# EAGLE design Infrared Temperature Sensor0.92 (EAGLE 5.11)
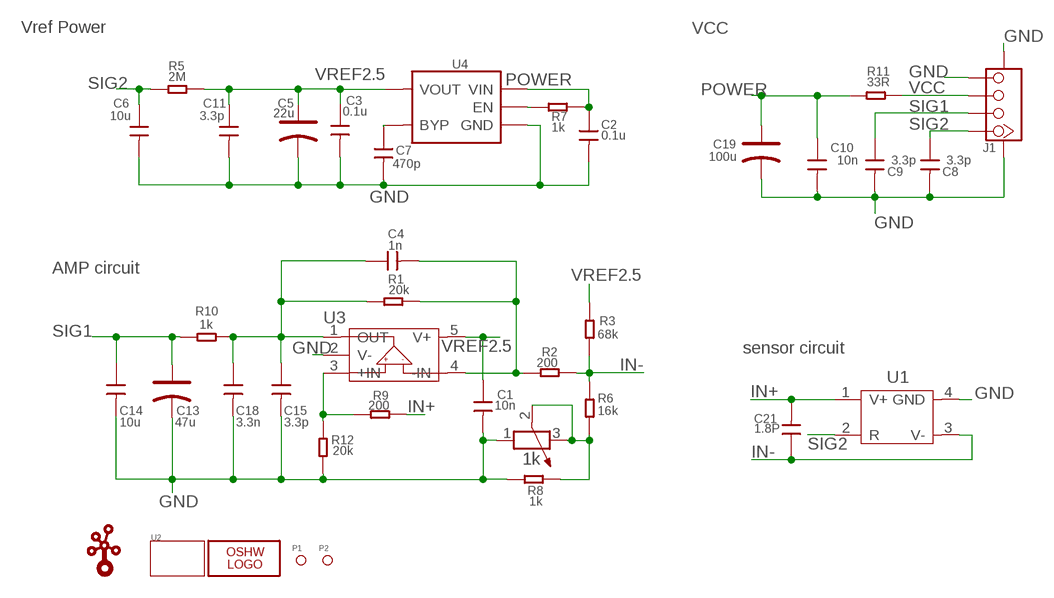
[diagram p0: schematic, sheet 1]

## Parts
C1  10n  C-0603  [0603]
C2  0.1u  C-0402  [0402]
C3  0.1u  C-0402  [0402]
C4  1n  C-0603  [0603]
C5  22u  CAP-AVX-A  [AVX-A]
C6  10u  C-0402  [0402]
C7  470p  C-0402  [0402]
C8  3.3p  C-0402  [0402]
C9  3.3p  C-0402  [0402]
C10  10n  C-0402  [0402]
C11  3.3p  C-0402  [0402]
C13  47u  CAP-AVX-A  [AVX-A]
C14  10u  C-0603  [0603]
C15  3.3p  C-0603  [0603]
C18  3.3n  C-0603  [0603]
C19  100u  CAP-AVX-B  [AVX-B]
C21  1.8P  C-0603  [0603]
J1  TWIG-4P-2.0-SMD-FEMALE-REINFORCE'90D'  [4P-SMD-2.0-90D]
LOGO1  LOGO-OSHW-FILLX0200-NT  [OSHW_FILLX200_NOTEXT]
P1  PAD-MARK  [ROUND-MARK-0.635]
P2  PAD-MARK  [ROUND-MARK-0.635]
R1  20k  R-0603  [0603]
R2  200  R-0603  [0603]
R3  68k  R-0603  [0603]
R4  1k  R-POTENTIOMETER-SMD  [3P-SMD-SQUA-3.6X3.3]
R5  2M  R-0402  [0402]
R6  16k  R-0603  [0603]
R7  1k  R-0402  [0402]
R8  1k  R-0603  [0603]
R9  200  R-0603  [0603]
R10  1k  R-0603  [0603]
R11  33R  R-0402  [0402]
R12  20k  R-0603  [0603]
U1  SENSOR-OTP-538U  [3P-5.4MM]
U2  TWIG-2U  [2U-DIM-W/-DRILL]
U3  OPA333  [SOT23-5]
U4  MIC5205  [SOT23-5]
U$1  LOGO-TWIG  [TWIGLOGO]

## Nets
GND: C1.2 C2.2 C3.2 C5.- C6.2 C7.2 C8.2 C9.2 C10.2 C11.2 C13.- C14.2 C15.2 C18.2 C19.- J1.4 J1.SS1 J1.SS2 R4.1 R8.1 R12.1 U1.4(GND) U3.2(V-) U4.2(GND)
IN+: C21.2 R9.1 U1.1(V+)
IN-: C21.1 R2.1 R3.2 R6.1 U1.3(V-)
N$1: C4.2 R1.1 R2.2 U3.4(-IN)
N$2: R4.2 R4.3 R6.2 R8.2
N$3: R7.1 U4.3(EN)
N$4: R9.2 R12.2 U3.3(+IN)
N$5: C7.1 U4.4(BYP)
N$10: C4.1 C15.1 C18.1 R1.2 R10.1 U3.1(OUT)
POWER: C2.1 C10.1 C19.+ R7.2 R11.1 U4.1(VIN)
SIG1: C9.1 C13.+ C14.1 J1.2 R10.2
SIG2: C6.1 C8.1 J1.1 R5.1 U1.2(R)
VCC: J1.3 R11.2
VREF2.5: C1.1 C3.1 C5.+ C11.1 R3.1 R5.2 U3.5(V+) U4.5(VOUT)

## Notes on the sheet
- Vref Power | VCC
- AMP circuit
- sensor circuit

## Library data of the parts
C1-C4 C6-C11 C14 C15 C18 C21 = Discrete:C*: Ceramic Capacitors
C5 C13 C19 = Discrete:CAP*: Electrolytic Capacitors,Tantalum Capacitors and Super Capacitors
J1 = Connector:TWIG-4P-2.0-SMD-FEMALE-REINFORCE
LOGO1 = Logo:LOGO-OSHW-FILL
P1 P2 = Discrete:PAD-MARK
R1-R3 R5-R12 = Discrete:R*
R4 = Discrete:R-POTENTIOMETER*: Potentiometer
U1 = Discrete:SENSOR-OTP-538U
U2 = Module:TWIG
U3 = IC:OPA333
U4 = IC:MIC5205: The MIC5205 is an efficient linear voltage regulator with ultra-low-noise output, very low dropout voltage (typically 17mV at light loads and 165mV at 150mA), and very low ground current (600µA at 100mA output). The MIC5205 offers better than 1% initial accuracy. datasheet here: http://www.micrel.com/product-info/prod/5205.shtml
U$1 = Logo:LOGO-TWIG

## Board
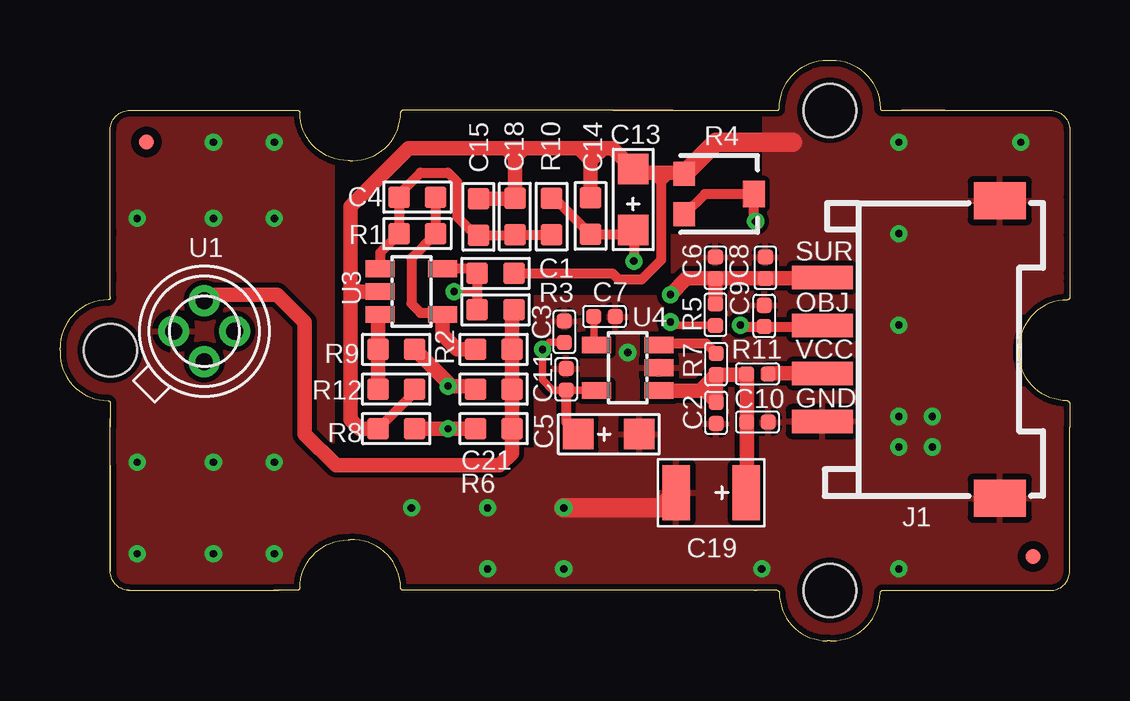
[diagram p1: board, top side]
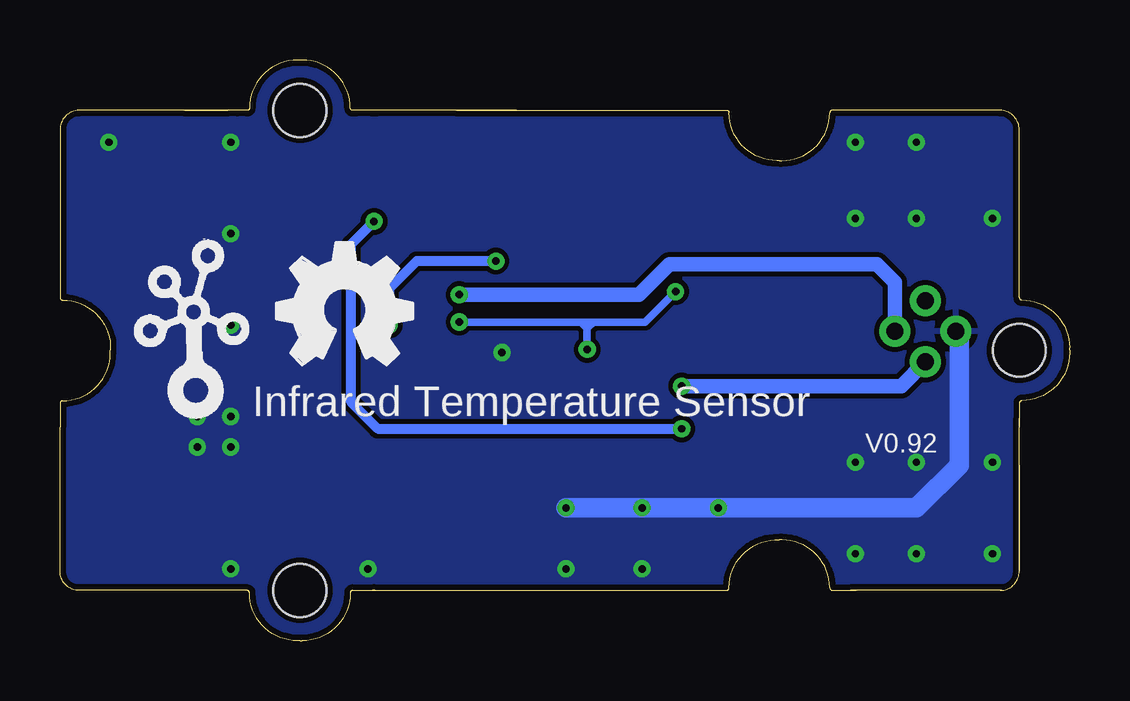
[diagram p2: board, bottom side, seen from below]

Size 42.09 x 24.2 mm. Coordinates in mm from the lower left corner, seen from the top.
Copper layers (1*16): Top 0.035mm / dielectric 1.5mm / Bottom 0.035mm
Design rules "default *": minimum track width 6mil, minimum drill 12mil, track to track 8mil, track to pad 8mil, pad to pad 8mil, via to via 8mil, smd to smd 8mil, copper to edge 10mil, drill to drill 8mil, minimum pad ring 10mil, minimum via ring 8mil, stop-mask expansion 4mil, vias tented up to drill 0mil, thermal gap 10mil
tRestrict: area 11.5,8.1 to 19.7,22; area 19.7,14.4 to 25.4,22; area 25.4,17 to 29.3,22

### Footprints (pad centres in the part's own frame; a part is rotated, then mirrored left to right if it is on the bottom)
0603 = smd 0.889 x 0.889: 1 -0.762,0; 2 0.762,0
0402 = smd 0.635 x 0.635: 1 -0.445,0; 2 0.445,0
AVX-A = smd 1.27 x 1.27: + -1.27,0; - 1.27,0
AVX-B = smd 1.143 x 2.286: + -1.46,0; - 1.46,0
4P-SMD-2.0-90D = smd 0.965 x 2.54: 1 -3,0; 2 -1,0; 3 1,0; 4 3,0 | smd 1.55 x 2.184: SS1 -6.2,7.4; SS2 6.2,7.4
ROUND-MARK-0.635 = smd 0.635 x 0.635: P$1 0,0
3P-SMD-SQUA-3.6X3.3 = smd 1 x 0.9: 1 -0.85,-1.45; 3 0.85,-1.45 | smd 1.1 x 0.9: 2 0,1.45
3P-5.4MM = drill 0.7 pad 1.3 round: 1 0.9,-0.9; 2 0.9,0.9; 3 -0.9,0.9; 4 -0.9,-0.9
2U-DIM-W/-DRILL = hole 2.2: 10.453,-10.42; 10.453,9.58; -19.535,-0.415
SOT23-5 = smd 0.69 x 1.2: 1 -0.95,-1.3; 2 0,-1.3; 3 0.95,-1.3; 4 0.95,1.3; 5 -0.95,1.3

### Placement (x,y rotation side)
C1  18.16,15.31 0 top
C2  27.35,9.5 270 top
C3  21.03,12.88 90 top
C4  14.9,18.49 0 top
C5  22.88,8.61 0 top
C6  27.32,15.54 90 top
C7  22.7,13.51 0 top
C8  29.41,15.54 90 top
C9  29.36,13.54 90 top
C10  29.08,9.12 0 top
C11  21.1,10.89 90 top
C13  23.9,18.39 90 top
C14  22.12,17.7 90 top
C15  17.44,17.66 90 top
C18  18.97,17.68 90 top
C19  27.15,6.17 180 top
C21  18.08,10.49 180 top
J1  31.78,12.14 270 top
LOGO1  33.06,11.5 0 bottom
P1  3.6,20.77 0 top
P2  40.56,3.5 0 top
R1  14.9,16.96 180 top
R2  18.08,12.14 180 top
R3  18.16,13.79 0 top
R4  27.48,18.62 270 top
R5  27.32,13.59 270 top
R6  18.08,8.84 180 top
R7  27.35,11.53 270 top
R8  14.02,8.84 0 top
R9  14.02,12.14 180 top
R10  20.49,17.68 90 top
R11  29.08,11.12 0 top
R12  14.02,10.49 180 top
U1  6.01,12.9 315 top
U2  21.64,12.52 0 top
U3  14.65,14.55 270 top
U4  23.67,11.38 90 top
U$1  36.49,10.23 0 bottom

### Tracks (layer width: path | path; a pad name or v marks a point on that pad's centre or on a via)
GND  (via drill 0.3 pad 0.64)
  Top 0.305: 12.11,15.06 12.62,14.55
  Top 0.406: R12.1 14.78,10.36 R8.1 | 25.06,19.12 25.45,19.5 | 25.06,19.12 25.06,15.87 24.25,15.06 23.29,15.06 23.03,15.31 C1.2 | 25.06,19.12 24.81,19.38 | 25.9,19.5 25.99,19.5
  Top 0.61: 12.36,14.55 12.24,14.55 12.11,14.42 | U3.2 12.62,14.55 12.36,14.55 | 22.27,20.52 23.03,20.52 C13.- 24.05,19.5 25.45,19.5 25.9,19.5 | 22.27,20.52 19.35,20.52 | 19.35,20.52 19.1,20.52 | 19.1,20.52 18.59,20.52 | 18.59,20.52 14.52,20.52 12.11,18.11 12.11,15.06 12.11,14.42 | 22.12,20.29 C14.2 | 22.27,20.52 22.12,20.37 22.12,20.29 | 19.1,20.52 18.97,20.39 18.97,20.14 | 18.95,18.42 C15.2 | 12.11,14.42 12.11,14.3 | 12.11,14.3 12.11,9.22 12.49,8.84 R8.1 | 18.97,20.14 18.59,20.52 | 18.97,20.14 C18.2 | 19.35,20.52 18.97,20.14 | 22.27,20.14 22.21,20.08 22.08,20.08 21.7,20.46 | 22.27,20.14 22.59,20.46 | 22.12,20.29 22.27,20.14 | 12.36,14.55 12.11,14.3
  Top 0.813: C18.2 18.95,18.42 | 25.99,19.5 R4.1 27.34,20.77 30.53,20.77 | v21,5.53 25.05,5.53 C19.-
  Bottom 0.813: U1.4 4.61,12.76 4.61,7.32 6.4,5.53 v21,5.53
  other vias: 23.67,12.01 17.83,2.99 14.65,5.53 29.26,2.99 34.97,2.99 34.97,20.77 34.97,16.96 34.97,9.34 34.97,13.15 40.05,20.77 17.83,5.53 21,2.99 6.4,20.77 8.94,20.77 8.94,17.6 6.4,17.6 3.22,17.6 3.22,3.63 6.4,3.63 8.94,3.63 8.94,7.44 6.4,7.44 3.22,7.44 34.97,8.07 36.37,8.07 36.37,9.34
  pour Top: -0.59,-0.82 -0.59,24.59 42.59,24.59 42.59,-0.82
  pour Bottom: -0.59,-0.82 -0.59,24.59 42.59,24.59 42.59,-0.82
IN+  (via drill 0.3 pad 0.64)
  Top 0.61: 14.9,12.14 R9.1 16.17,10.74 v16.17,10.62 17.19,10.62 C21.2
  Bottom 0.61: v16.17,10.62 7.03,10.62 U1.1
IN-
  Top 0.61: U1.3 6.27,14.42 9.06,14.42 10.21,13.28 10.21,8.6 11.5,7.3 18.32,7.3 18.84,7.82 R6.1 C21.1 R2.1 18.84,13.71 R3.2
N$1
  Top 0.406: C4.2 R1.1 14.65,15.95 14.65,14.04 15.03,13.66 15.89,13.66 U3.4
  Top 0.61: U3.4 15.95,12.74 16.55,12.14 R2.2
N$2  (via drill 0.3 pad 0.64)
  Top 0.406: 26.07,17.73 R4.3 26.88,18.62 R4.2 28.93,17.55 v29,17.47
  Top 0.61: R8.2 v16.17,8.84 R6.2
  Bottom 0.406: v16.17,8.84 28.84,8.84 29.95,9.95 29.95,16.52 v29,17.47
N$3
  Top 0.406: U4.3 25.03,12.39 26.93,12.39 R7.1
N$4
  Top 0.61: U3.3 13.25,13.6 R9.2 R12.2
N$5
  Top 0.305: C7.1 22.26,12.44 U4.4
N$10
  Top 0.406: R10.1 C18.1 18.95,16.9 C15.1 17.38,16.84 16.55,17.66 16.55,19.12 16.17,19.5 15.03,19.5 14.14,18.62 C4.1 R1.2 13.35,16.17 U3.1
POWER
  Top 0.61: C10.1 28.62,9.13 | R7.2 28.6,11.08 R11.1 C10.1 | U4.1 | 26.69,10.43 U4.1 | R7.2 26.69,10.43 | 27.35,9.98 C2.1 | R7.2 27.35,9.98 | 26.69,10.43 26.9,10.43 27.35,9.98 | C10.1 28.63,6.19 C19.+
SIG1  (via drill 0.3 pad 0.64)
  Top 0.406: J1.2 31.73,13.09 C9.1 28.43,13.09 v28.37,13.15 | R10.2 20.62,18.44 C14.1 23.72,16.94 C13.+ 23.92,17.09 v23.92,15.82
  Bottom 0.406: v23.92,15.82 27.22,15.82 28.37,14.68 v28.37,13.15
SIG2  (via drill 0.3 pad 0.64)
  Top 0.61: J1.1 31.74,15.1 C8.1 C6.1 | C6.1 R5.1 | C6.1 26.12,15.1 v25.45,14.42
  Bottom 0.61: v25.45,14.42 17.95,14.42 16.68,15.7 8.05,15.7 7.28,14.93 U1.2
VCC
  Top 0.61: J1.3 29.52,11.14 R11.2
VREF2.5  (via drill 0.3 pad 0.64)
  Top 0.305: U4.5 22.34,10.45 C11.1 20.53,10.45 20.11,10.87 v20.11,12.14 20.4,12.43 C3.1 | R5.2 25.59,13.14 v25.45,13.28 | v16.43,14.55 17.06,14.55 17.19,14.55 | 17.39,14.68 17.27,14.55 17.19,14.55 | 17.19,14.55 17.32,14.68 | 17.19,14.55 17.44,14.3
  Top 0.406: U3.5 17.21,15.5 C1.1 17.39,14.68 R3.1 | C11.1 21.1,9.12 C5.+
  Bottom 0.305: 19.86,13.28 17.7,13.28 v16.43,14.55 | 19.86,13.28 20.37,13.28 | 20.37,13.28 v25.45,13.28 | 20.11,13.03 v20.11,12.14 | 20.37,13.28 20.11,13.03 | 19.86,13.28 20.11,13.03

### Text on the board
tPlace: SUR | OBJ | VCC | GND
bPlace: Infrared Temperature Sensor | V0.92